# Altium schematic sheet RF_PDU.SchDoc
size 279 x 215 mm; SheetNumber: 6; SheetTotal: 6
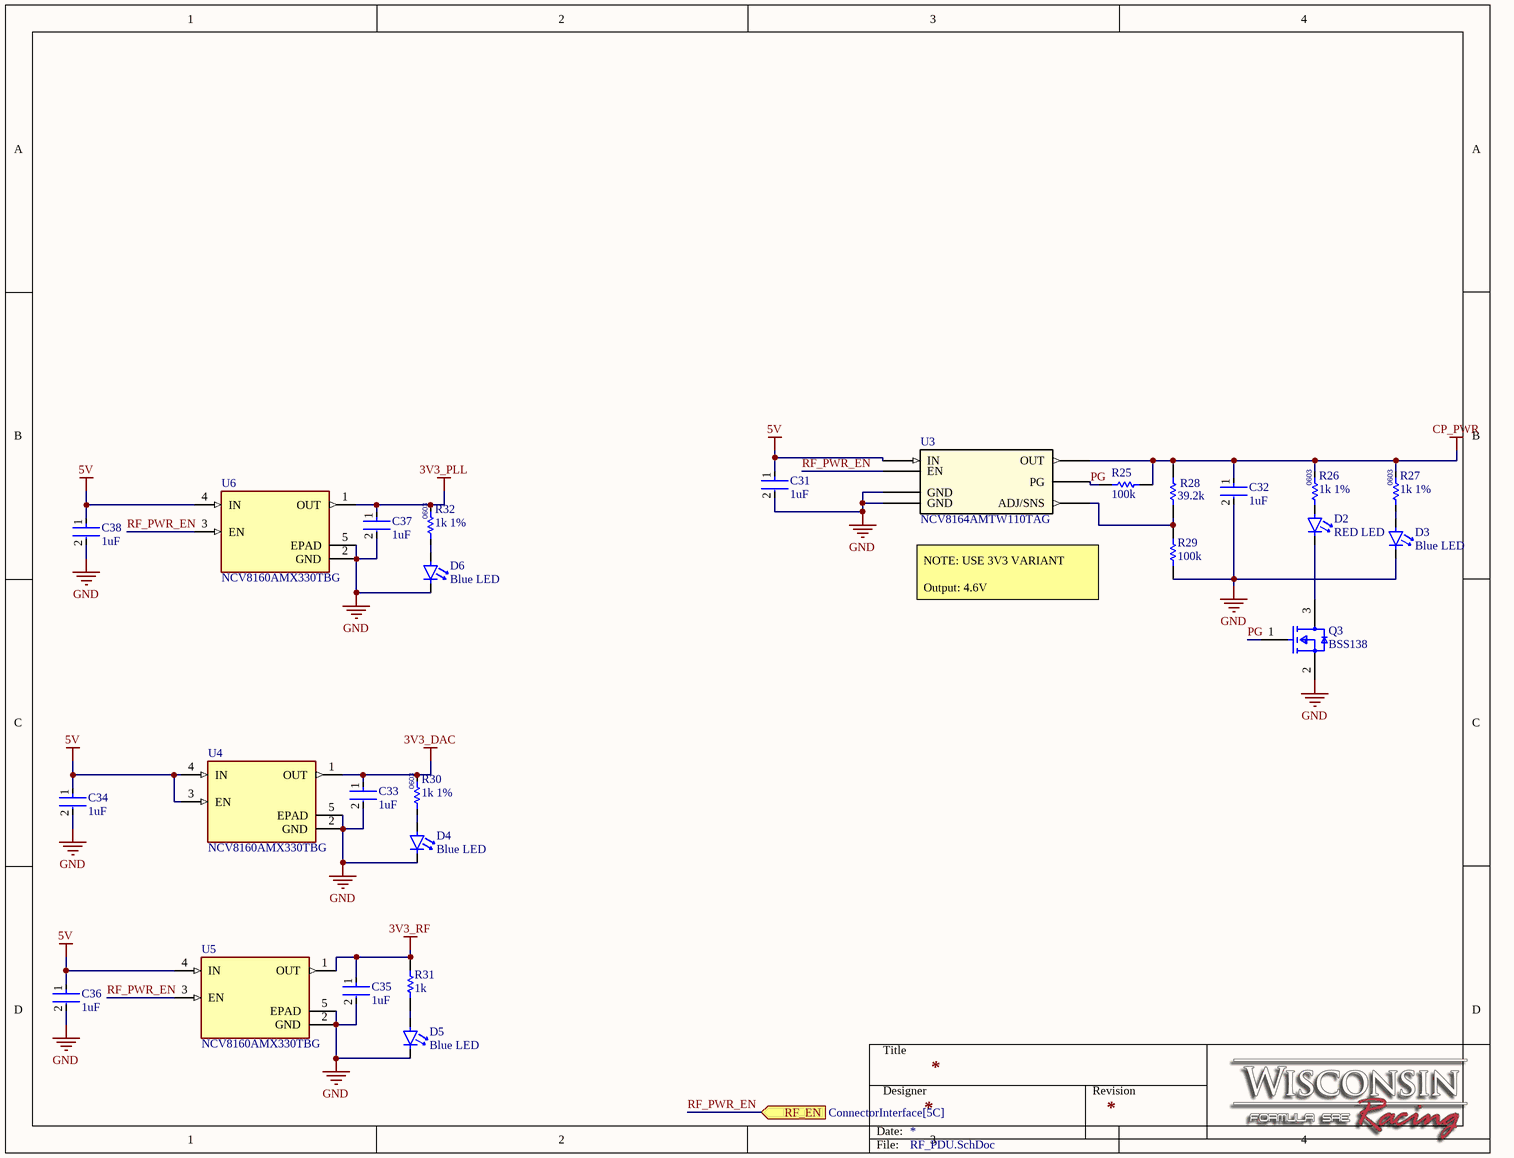
[diagram p0: RF_PDU.SchDoc]

## Parts
C31  1uF  [FP-GRM155-0_1-IPC_C]
C32  1uF  [FP-GRM155-0_1-IPC_C]
C33  1uF  [FP-GRM155-0_1-IPC_C]
C34  1uF  [FP-GRM155-0_1-IPC_C]
C35  1uF  [FP-GRM155-0_1-IPC_C]
C36  1uF  [FP-GRM155-0_1-IPC_C]
C37  1uF  [FP-GRM155-0_1-IPC_C]
C38  1uF  [FP-GRM155-0_1-IPC_C]
D2  RED LED  [DIOC1608X05N]
D3  Blue LED  [0603-LED-1]
D4  Blue LED  [0603-LED-1]
D5  Blue LED  [0603-LED-1]
D6  Blue LED  [0603-LED-1]
Q3  BSS138  [FP-318-08-IPC_B]
R25  100k  [RESC1005X40X25NL05T10]
R26  1k 1%  [Res0603-type-1]
R27  1k 1%  [Res0603-type-1]
R28  39.2k  [RESC1005X40X25ML05T10]
R29  100k  [RESC1005X40X25NL05T10]
R30  1k 1%  [Res0603-type-1]
R31  1k  [RESC1005X40X25LL05T10]
R32  1k 1%  [Res0603-type-1]
U3  NCV8164AMTW110TAG  [WDFNW6_511DW_OSI]
U4  NCV8160AMX330TBG  [VREG_NCV8160AMX330TBG]
U5  NCV8160AMX330TBG  [VREG_NCV8160AMX330TBG]
U6  NCV8160AMX330TBG  [VREG_NCV8160AMX330TBG]

## Ports
RF_EN (in, see ConnectorInterface[5C])

## Nets
3V3_DAC: C33.1 R30.2 U4.1(OUT)
3V3_PLL: C37.1 R32.2 U6.1(OUT)
3V3_RF: C35.1 R31.2 U5.1(OUT)
5V: C31.1 C34.1 C36.1 C38.1 U3.6(IN) U4.3(EN) U4.4(IN) U5.4(IN) U6.4(IN)
CP_PWR: C32.1 R25.1 R26.2 R27.2 R28.2 U3.1(OUT)
GND: C31.2 C32.2 C33.2 C34.2 C35.2 C36.2 C37.2 C38.2 D3.1(C) D4.1(C) D5.1(C) D6.1(C) Q3.2(S) R29.1 U3.5(GND) U3.7(GND) U4.2(GND) U4.5(EPAD) U5.2(GND) U5.5(EPAD) U6.2(GND) U6.5(EPAD)
PG: Q3.1(G) R25.2 U3.3(PG)
RF_PWR_EN: U3.4(EN) U5.3(EN) U6.3(EN) ; port RF_EN
NetD2_1: D2.1(C) Q3.3(D)
NetD3_2: D3.2(A) R27.1
NetD4_2: D4.2(A) R30.1
NetD5_2: D5.2(A) R31.1
NetD6_2: D6.2(A) R32.1
NetR28_1: R28.1 R29.2 U3.2(ADJ/SNS)

Not connected (* = marked no-connect by the designer): D2 2(A); R26 1

## Notes on the sheet
- NOTE: USE 3V3 VARIANT
  Output: 4.6V
- Title
- Designer
- Revision
- Date:
- File:
- (in symbol CMP-005-000017-1) 0603

## Library data of the parts
C31-C38 = CMP-06035-028020-1: Chip Multilayer Ceramic Capacitors for General Purpose, 0402, 1.0uF, X7R, 15%, 10%, 10V / GRM155Z71A105KE01D
D2 = CMP-221-0013-1: 0603 Red SMD Led; Datasheet: https://www.aopled.com/AOP_PDFs/L196L-LIC.pdf
D3-D6 = CMP-LED-0000-10: Single Color LED, Blue, Water Clear, 1.1mm; Lens Color: Colorless; Wavelength: 468nm; Luminous Intensity: 180mcd; Number of Elements: 1; Power Dissipation: 76mW; Max Power Dissipation: 75mW; Forward Current: 20mA; Forward Voltage: 3.8V; Lens Style: Diffused,Colorless,Clear,Rectangular; Dominant Wavelength: 475nm; Viewing Angle: 130°; Reverse Voltage: 5V; Length: 0.8mm; Max Operating Temperature: 80°C; Height: 0.55mm; Mount: Surface Mount; Number of Pins: 2; Lens Transparency: Clear; Color: Blue; Radiation Hardening: No; Illumination Color: Blue; Depth: 1.6mm; Packaging: Tape and Reel; Case Code (Imperial): 0603; Number of LEDs: 1; Lead Free: Lead Free; Case Code (Metric): 1608; Width: 0.8mm; Min Operating Temperature: -20°C; Case/Package: 0603; Package Quantity: 1; Test Current: 20mA
Q3 = CMP-07173-000101-1: MOSFET N-CH 50V 220MA SOT-23; Turn-Off Delay Time: 20ns; Element Configuration: Single; Rds On Max: 3.5R; Gate to Source Voltage (Vgs): 20V; Threshold Voltage: 1.3V; Number of Elements: 1; Power Dissipation: 360mW; Rise Time: 9ns; Turn-On Delay Time: 2.5ns; Input Capacitance: 27pF; On-State Resistance: 6R; Lead Free: Lead Free; Length: 2.92mm; Width: 1.3mm; Drain to Source Breakdown Voltage: 50V; Min Operating Temperature: -55°C; REACH SVHC: No SVHC; Packaging: Tape and Reel; Radiation Hardening: No; Height: 0.93mm; Drain to Source Voltage (Vdss): 50V; Current Rating: 220mA; Voltage Rating (DC): 50V; Weight: 0.03g; Continuous Drain Current (ID): 220mA; Number of Pins: 3; Nominal Vgs: 1.3V; Max Power Dissipation: 360mW; Fall Time: 9ns; Drain to Source Resistance: 3.5R; Contact Plating: Tin; Case/Package: SOT-23; Package Quantity: 1; Dual Supply Voltage: 50V; Mount: Surface Mount; Termination: SMD/SMT; Max Operating Temperature: 150°C
R25 R29 = CMP-2002-07343-1: Part Number: RC0402FR-07100KL; Manufacturer: Yageo / Phycomp
R26 R27 R30 R32 = CMP-005-000017-1: Fixed Resistor, Metal Glaze/thick Film, 0.1W, 1000ohm, 75V, 1% +/-Tol, 100ppm/Cel, Surface Mount, 0603; Min Operating Temperature: -55°C; Mount: Surface Mount; Packaging: Tape and Reel; Max Operating Temperature: 155°C
R28 = CMP-2002-07644-1: Part Number: RC0402FR-0739K2L; Manufacturer: Yageo
R31 = CMP-2002-07941-1: Part Number: RC0402JR-071KL; Manufacturer: Yageo / Phycomp
U3 = CMP-196-000000-3: LDO; Manufacturer_Name: onsemi; Source: NCV8164AMTW110TAG.SchLib; RefDes: RefDes; Design Item ID: NCV8164AMTW110TAG; Copyright: Copyright (C) 2025 Ultra Librarian. All rights reserved.; Manufacturer_Part_Number: NCV8164AMTW110TAG; Type: Power Management
U4-U6 = CMP-006-000097-1: Linear Voltage Regulator IC Positive Fixed 1 Output 250mA 4-XDFN (1x1); MF: ON Semiconductor; Design Item ID: NCV8160AMX330TBG; SnapEDA_Link: https://www.snapeda.com/parts/NCV8160AMX330TBG/Onsemi/view-part/?ref=snap; Pin Count: 5; Check_prices: https://www.snapeda.com/parts/NCV8160AMX330TBG/Onsemi/view-part/?ref=eda; Value: *; MP: NCV8160AMX330TBG; Source: NCV8160AMX330TBG.SchLib; Component Type: Standard; Package: XDFN-4 ON Semiconductor